# EasyEDA schematic SCH_Monitoring_solar_panel_2024-04-25.json
TITLE: Caractérisation électrique d'un ppv a distance; REV: 1.0; Date: 2024-04-25; Sheet: 1/1; Company: Les geeks de la technologie
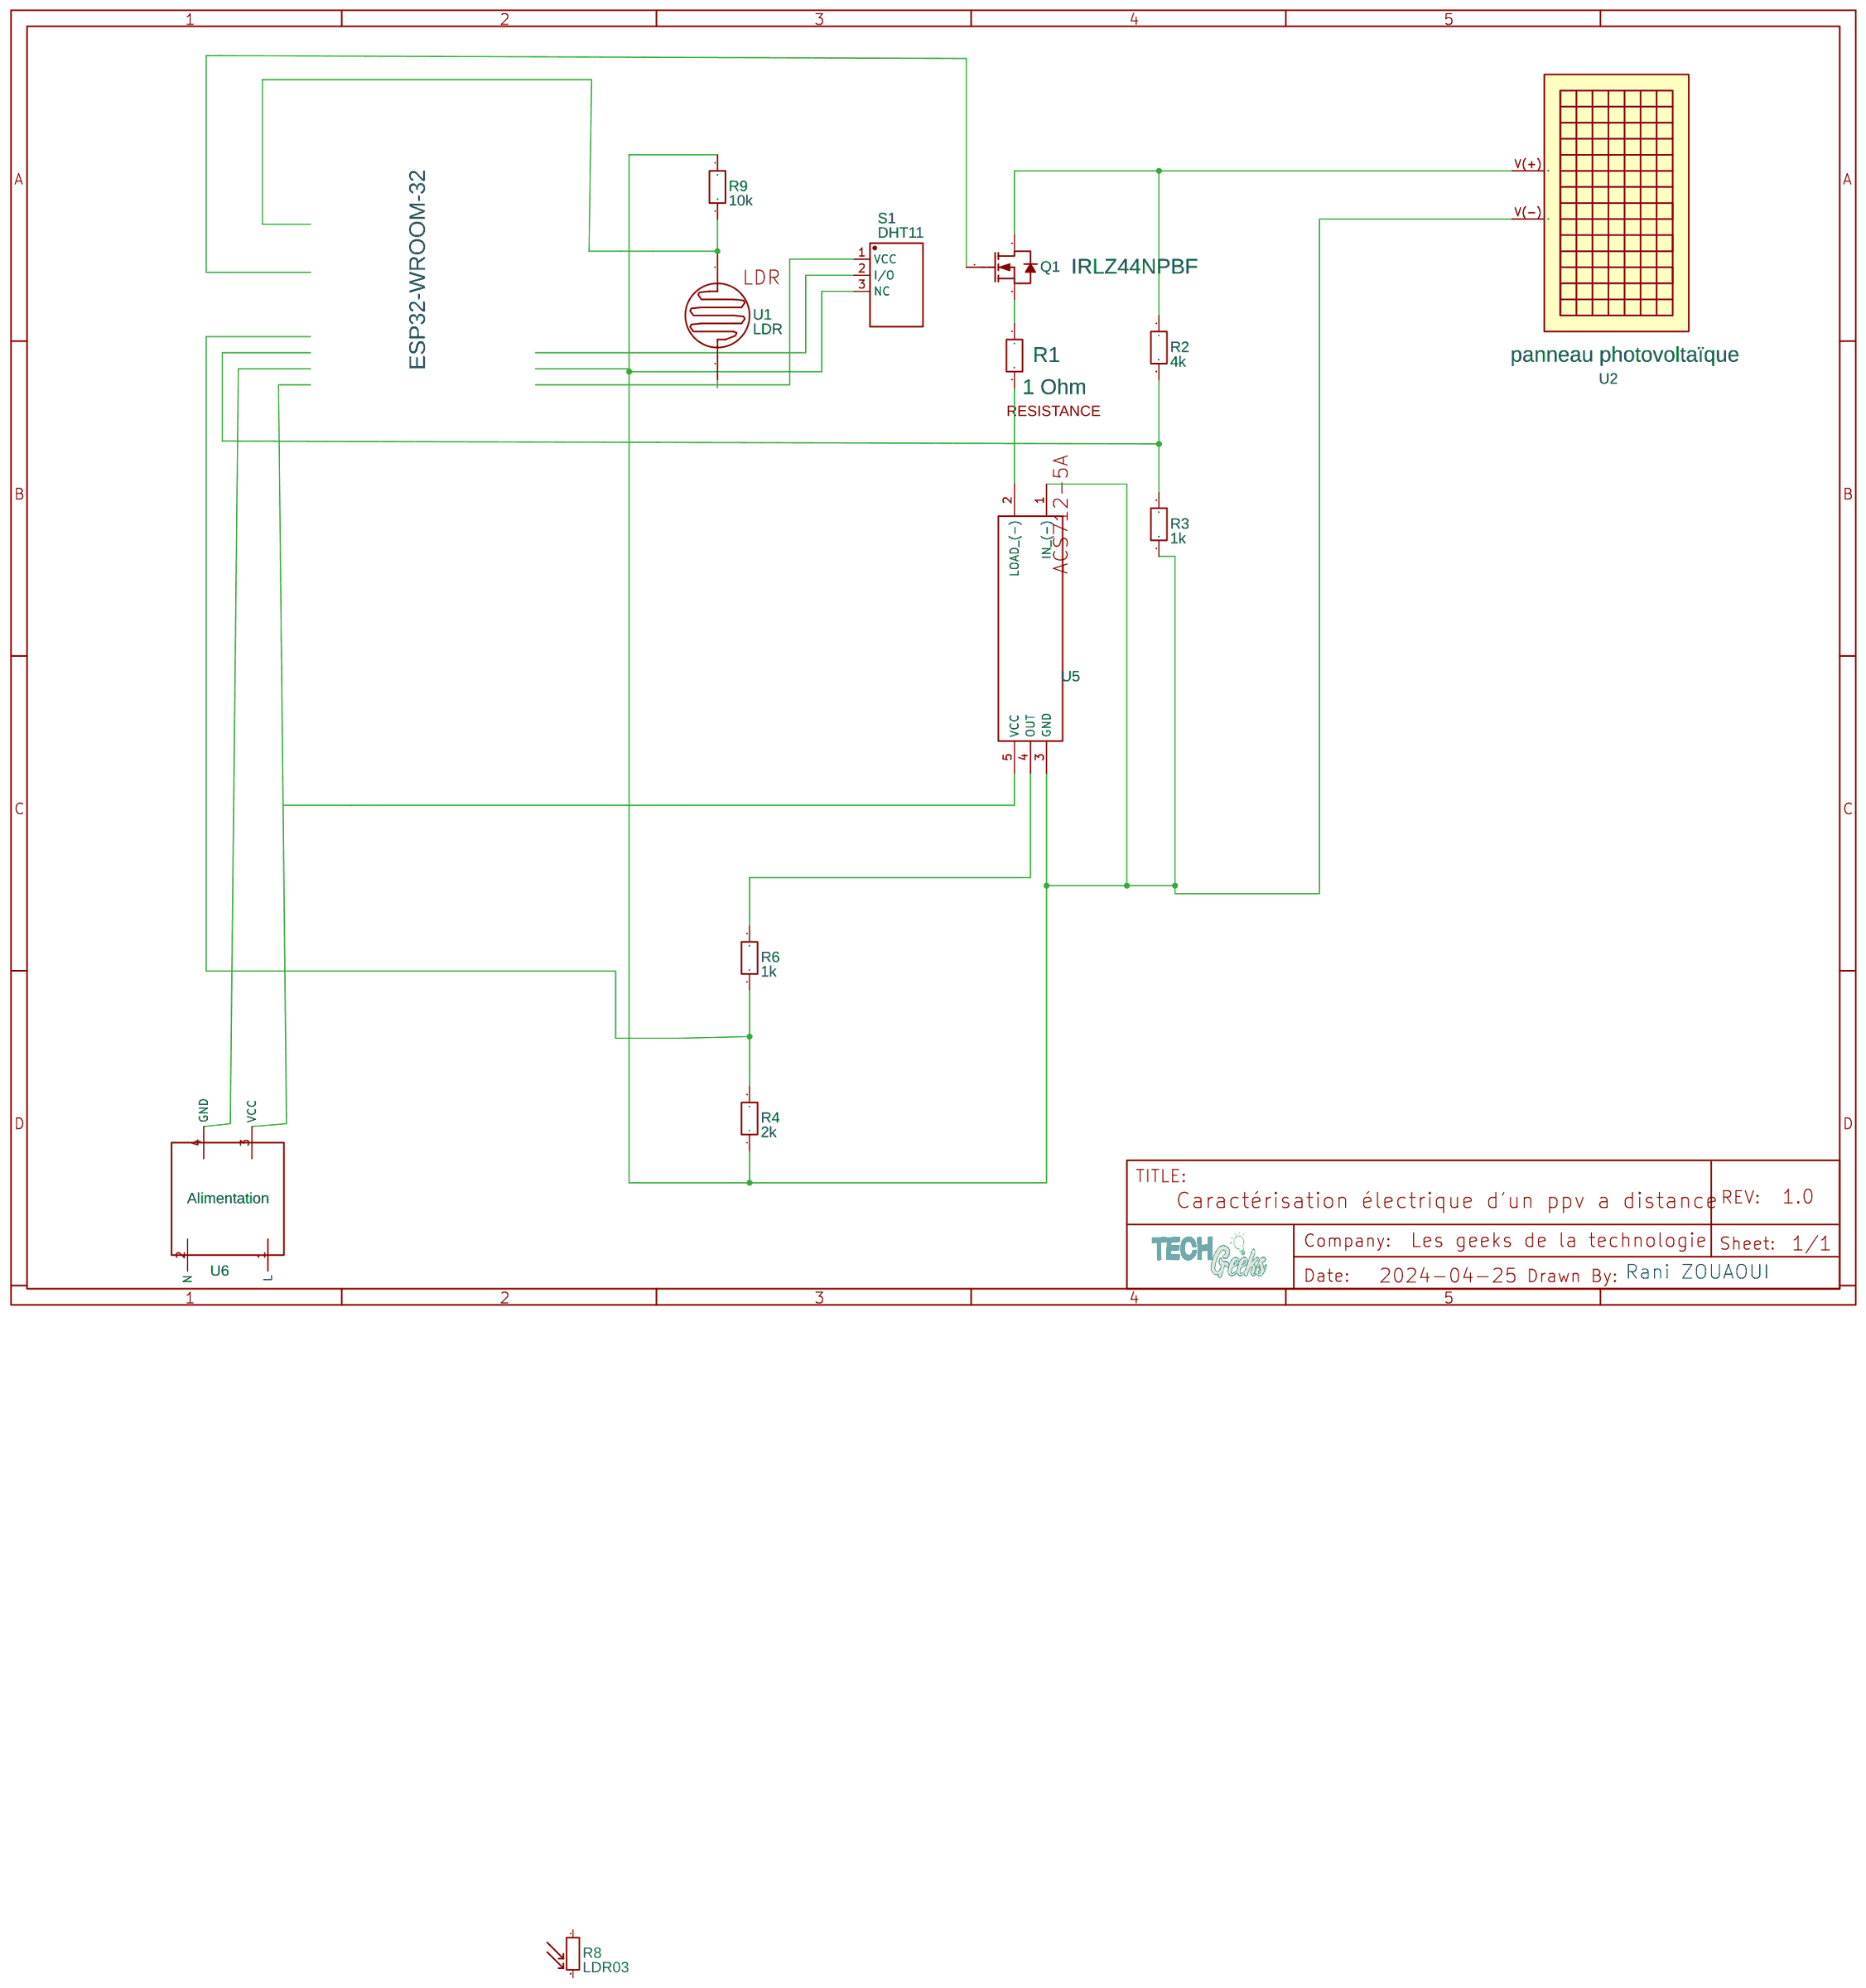
[diagram p0: schematic sheet]

## Parts
Q1  IRLZ44NPBF  [TO-220-3_L10.0-W4.5-P2.54-T]
R1  1 Ohm  [RESISTANCE]
R2  4k  [R0201]
R3  1k  [R0201]
R4  2k  [R0201]
R6  1k  [R0201]
R8  LDR03  [RESISTOR_LDR_10X8.5_RM7.6]
R9  10k  [R0201]
S1  DHT11  [DHT11]
U1  LDR  [LDR]
U2  panneau photovoltaïque
U5  ACS712  [ACS712]
U6  Alimentation  [ALIMENTATION]

## Library data of the parts
Q1 = IRLZ44NPBF: Supplier: LCSC; Manufacturer: IR; Supplier Part: C38774
R1 = RESISTANCE: Manufacturer Part: Resistor 10mm; Contributor: digitalPatrick; Package Display: Yes
R2-R4 R6 R9 = R_0201_EU: Contributor: LCEDA_Lib
R8 = LDR03: Contributor: KiCAD; license: https://www.gnu.org/licenses/lgpl-2.1.html
S1 = DHT11: Supplier: LCSC; Manufacturer: AOSONG; Contributor: mihailvost
U1 = LDR: Contributor: victor1306716882
U2 = Panneaux solaire: Manufacturer: VICTRON; Contributor: GRUAU
U5 = ACS712: Manufacturer Part: New SchematicLib; Contributor: sergiofeasyeda
U6 = Alimentation: Contributor: LoicNC

## Nets
Net-(Q1-2): Q1.2(D) R2.1 U2.V(+)(1)
Net-(Q1-3): Q1.3(S) R1.1
Net-(R1-2): R1.2 U5.2(LOAD (-))
Net-(R2-2): R2.2 R3.1
Net-(R3-2): R3.2 R4.1 R9.1 S1.3(NC) U2.V(-)(2) U5.1(IN (-)) U5.3(GND)
Net-(R4-2): R4.2 R6.1
Net-(R6-2): R6.2 U5.4(OUT)
Net-(R9-2): R9.2 U1.1

Not connected (* = marked no-connect by the designer): Q1 1(G); R8 1 2; S1 1(VCC) 2(I/O); U1 2; U5 5(VCC); U6 1(L) 2(N) 3(VCC) 4(GND)

## Notes on the sheet
- ESP32-WROOM-32
- Rani ZOUAOUI
